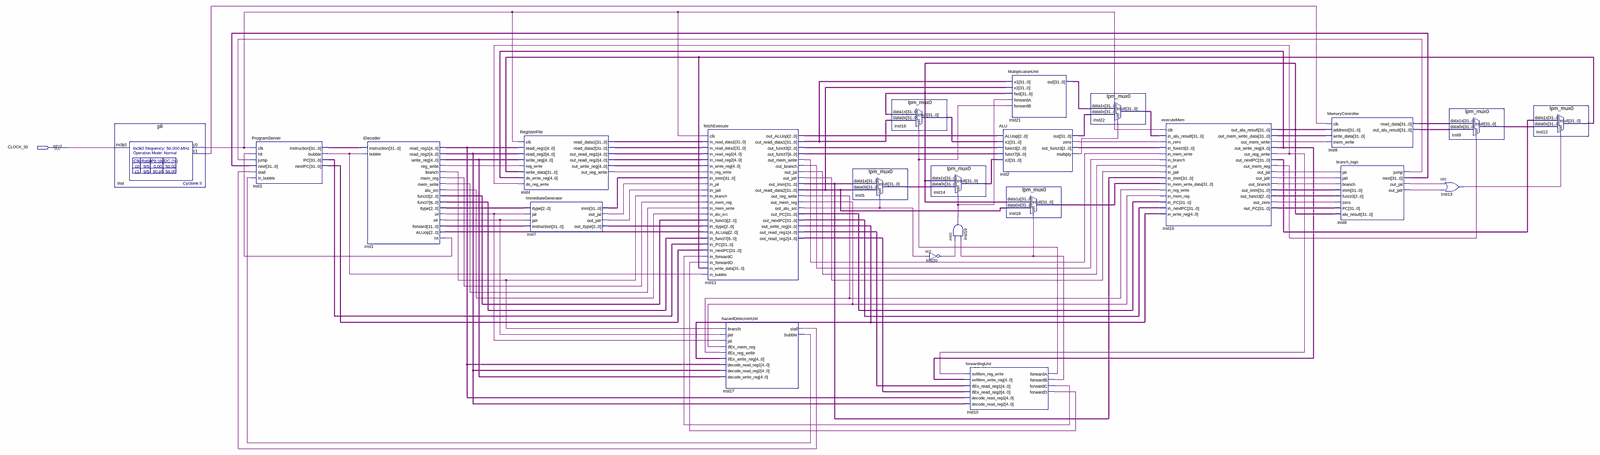
[diagram p0: schematic sheet, whole]
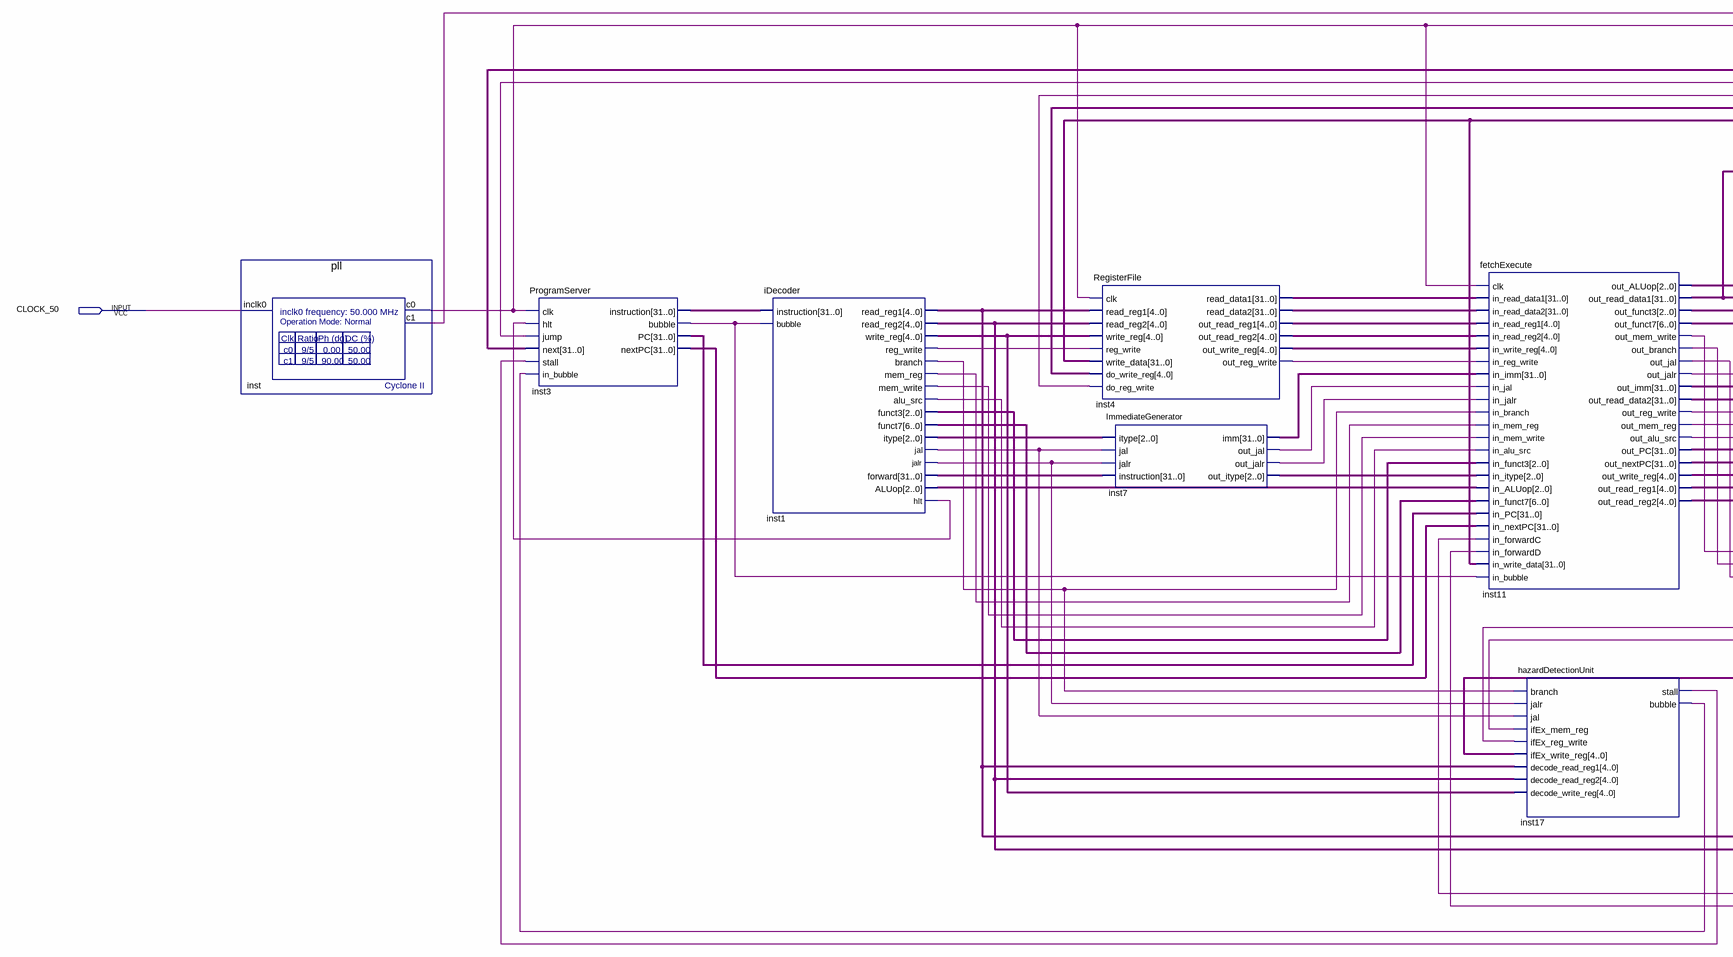
[diagram p1: schematic sheet, left part]
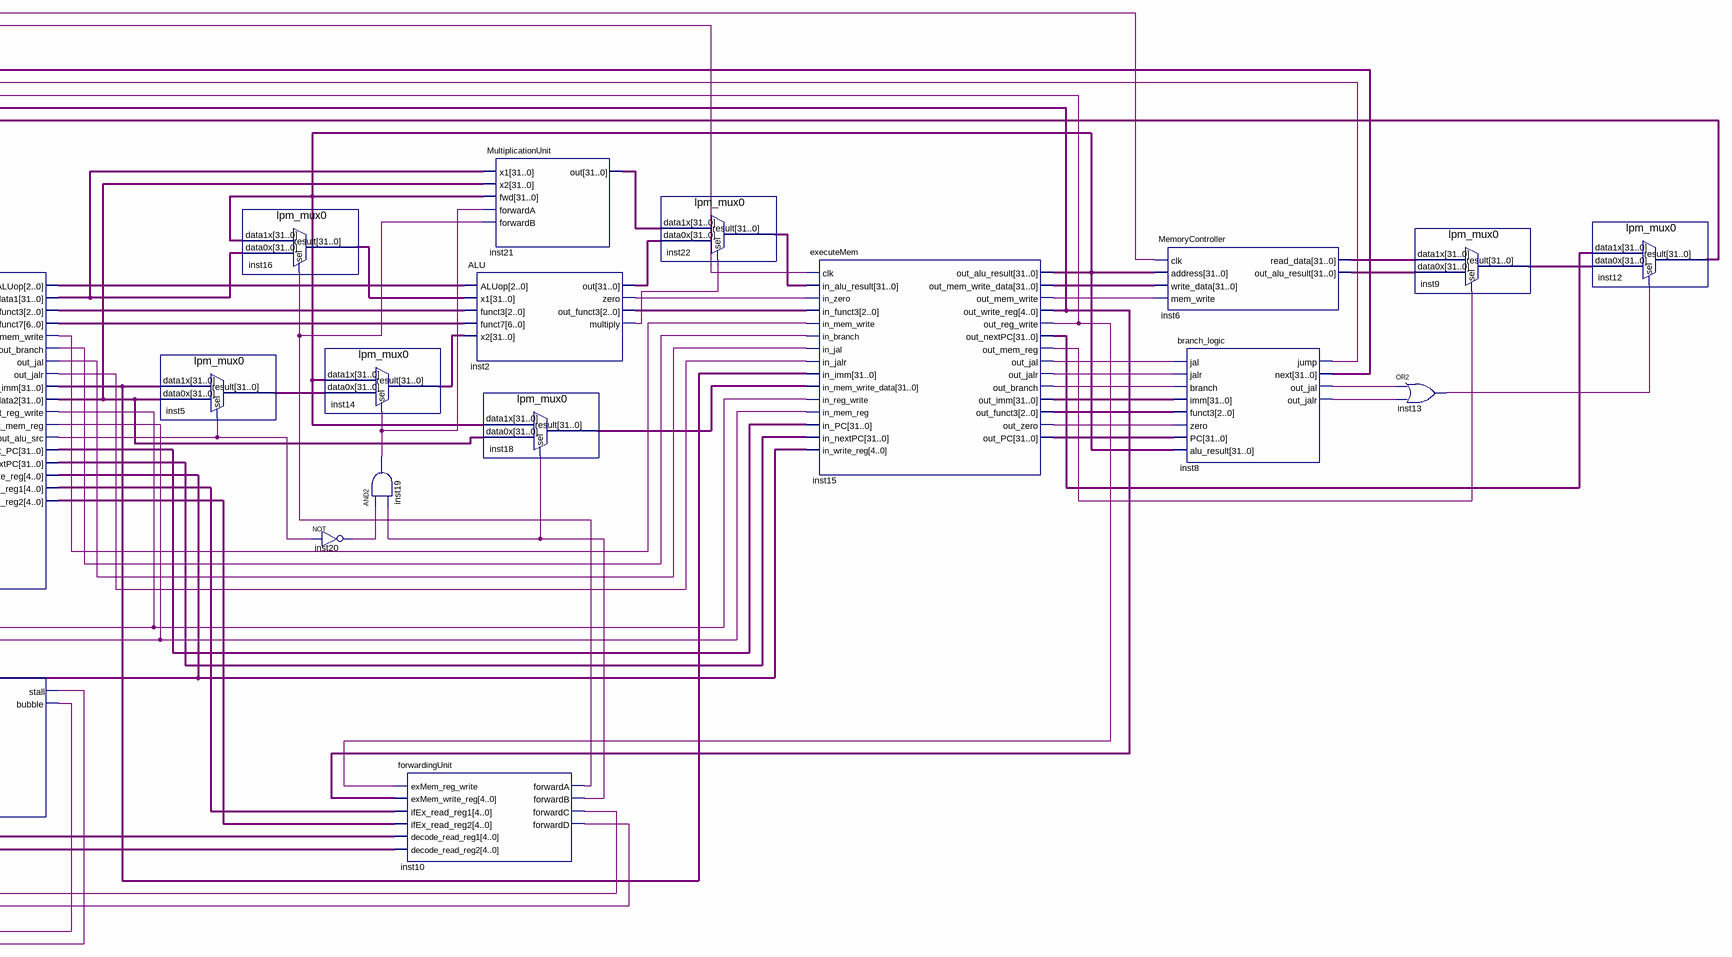
[diagram p2: schematic sheet, right part]
// Quartus schematic pipeline.bdf as structural Verilog: 23 symbols, 1 pins
module pipeline (
  input  CLOCK_50
);

  wire inst1_alu_src, inst1_branch, inst1_hlt, inst1_jal, inst1_jalr, inst1_mem_reg, inst1_mem_write,
       inst1_reg_write, inst2_multiply, inst2_zero, inst3_bubble, inst4_out_reg_write, inst7_out_jal,
       inst7_out_jalr, inst8_jump, inst8_out_jal, inst8_out_jalr, inst10_forwarda, inst10_forwardb,
       inst10_forwardc, inst10_forwardd, inst11_out_alu_src, inst11_out_branch, inst11_out_jal,
       inst11_out_jalr, inst11_out_mem_reg, inst11_out_mem_write, inst11_out_reg_write, inst13_out,
       inst15_out_branch, inst15_out_jal, inst15_out_jalr, inst15_out_mem_reg, inst15_out_mem_write,
       inst15_out_reg_write, inst15_out_zero, inst17_bubble, inst17_stall, inst19_out, inst20_out, inst_c0,
       inst_c1;
  wire [2:0] inst1_aluop, inst1_funct3, inst1_itype, inst2_out_funct3, inst7_out_itype, inst11_out_aluop,
       inst11_out_funct3, inst15_out_funct3;
  wire [4:0] inst1_read_reg1, inst1_read_reg2, inst1_write_reg, inst4_out_read_reg1, inst4_out_read_reg2,
       inst4_out_write_reg, inst11_out_read_reg1, inst11_out_read_reg2, inst11_out_write_reg,
       inst15_out_write_reg;
  wire [6:0] inst1_funct7, inst11_out_funct7;
  wire [31:0] inst1_forward, inst2_out, inst3_instruction, inst3_nextpc, inst3_pc, inst4_read_data1,
       inst4_read_data2, inst5_result, inst6_out_alu_result, inst6_read_data, inst7_imm, inst8_next,
       inst9_result, inst11_out_imm, inst11_out_nextpc, inst11_out_pc, inst11_out_read_data1,
       inst11_out_read_data2, inst12_result, inst14_result, inst15_out_alu_result, inst15_out_imm,
       inst15_out_mem_write_data, inst15_out_nextpc, inst15_out_pc, inst16_result, inst18_result, inst21_out,
       inst22_result;

  pll inst (.inclk0(CLOCK_50), .c0(inst_c0), .c1(inst_c1));
  ProgramServer inst3 (
    .clk(inst_c0), .hlt(inst1_hlt), .jump(inst8_jump), .next(inst8_next), .stall(inst17_stall),
    .in_bubble(inst17_bubble), .instruction(inst3_instruction), .bubble(inst3_bubble), .PC(inst3_pc),
    .nextPC(inst3_nextpc));
  iDecoder inst1 (
    .instruction(inst3_instruction), .bubble(inst3_bubble), .read_reg1(inst1_read_reg1),
    .read_reg2(inst1_read_reg2), .write_reg(inst1_write_reg), .reg_write(inst1_reg_write),
    .branch(inst1_branch), .mem_reg(inst1_mem_reg), .mem_write(inst1_mem_write), .alu_src(inst1_alu_src),
    .funct3(inst1_funct3), .funct7(inst1_funct7), .itype(inst1_itype), .jal(inst1_jal), .jalr(inst1_jalr),
    .forward(inst1_forward), .ALUop(inst1_aluop), .hlt(inst1_hlt));
  RegisterFile inst4 (
    .clk(inst_c0), .read_reg1(inst1_read_reg1), .read_reg2(inst1_read_reg2), .write_reg(inst1_write_reg),
    .reg_write(inst1_reg_write), .write_data(inst12_result), .do_write_reg(inst15_out_write_reg),
    .do_reg_write(inst15_out_reg_write), .read_data1(inst4_read_data1), .read_data2(inst4_read_data2),
    .out_read_reg1(inst4_out_read_reg1), .out_read_reg2(inst4_out_read_reg2),
    .out_write_reg(inst4_out_write_reg), .out_reg_write(inst4_out_reg_write));
  ImmediateGenerator inst7 (
    .itype(inst1_itype), .jal(inst1_jal), .jalr(inst1_jalr), .instruction(inst1_forward), .imm(inst7_imm),
    .out_jal(inst7_out_jal), .out_jalr(inst7_out_jalr), .out_itype(inst7_out_itype));
  fetchExecute inst11 (
    .clk(inst_c0), .in_read_data1(inst4_read_data1), .in_read_data2(inst4_read_data2),
    .in_read_reg1(inst4_out_read_reg1), .in_read_reg2(inst4_out_read_reg2),
    .in_write_reg(inst4_out_write_reg), .in_reg_write(inst4_out_reg_write), .in_imm(inst7_imm),
    .in_jal(inst7_out_jal), .in_jalr(inst7_out_jalr), .in_branch(inst1_branch), .in_mem_reg(inst1_mem_reg),
    .in_mem_write(inst1_mem_write), .in_alu_src(inst1_alu_src), .in_funct3(inst1_funct3),
    .in_itype(inst7_out_itype), .in_ALUop(inst1_aluop), .in_funct7(inst1_funct7), .in_PC(inst3_pc),
    .in_nextPC(inst3_nextpc), .in_forwardC(inst10_forwardc), .in_forwardD(inst10_forwardd),
    .in_write_data(inst12_result), .in_bubble(inst3_bubble), .out_ALUop(inst11_out_aluop),
    .out_read_data1(inst11_out_read_data1), .out_funct3(inst11_out_funct3), .out_funct7(inst11_out_funct7),
    .out_mem_write(inst11_out_mem_write), .out_branch(inst11_out_branch), .out_jal(inst11_out_jal),
    .out_jalr(inst11_out_jalr), .out_imm(inst11_out_imm), .out_read_data2(inst11_out_read_data2),
    .out_reg_write(inst11_out_reg_write), .out_mem_reg(inst11_out_mem_reg), .out_alu_src(inst11_out_alu_src),
    .out_PC(inst11_out_pc), .out_nextPC(inst11_out_nextpc), .out_write_reg(inst11_out_write_reg),
    .out_read_reg1(inst11_out_read_reg1), .out_read_reg2(inst11_out_read_reg2));
  hazardDetectionUnit inst17 (
    .branch(inst1_branch), .jalr(inst1_jalr), .jal(inst1_jal), .ifEx_mem_reg(inst11_out_mem_reg),
    .ifEx_reg_write(inst11_out_reg_write), .ifEx_write_reg(inst11_out_write_reg),
    .decode_read_reg1(inst1_read_reg1), .decode_read_reg2(inst1_read_reg2),
    .decode_write_reg(inst1_write_reg), .stall(inst17_stall), .bubble(inst17_bubble));
  lpm_mux0 inst5 (
    .data1x(inst11_out_imm), .data0x(inst11_out_read_data2), .sel(inst11_out_alu_src), .result(inst5_result));
  lpm_mux0 inst16 (
    .data1x(inst15_out_alu_result), .data0x(inst11_out_read_data1), .sel(inst10_forwarda),
    .result(inst16_result));
  not inst20 (inst20_out, inst11_out_alu_src);
  lpm_mux0 inst14 (.data1x(inst15_out_alu_result), .data0x(inst5_result), .sel(inst19_out), .result(inst14_result));
  and inst19 (inst19_out, inst20_out, inst10_forwardb);
  forwardingUnit inst10 (
    .exMem_reg_write(inst15_out_reg_write), .exMem_write_reg(inst15_out_write_reg),
    .ifEx_read_reg1(inst11_out_read_reg1), .ifEx_read_reg2(inst11_out_read_reg2),
    .decode_read_reg1(inst1_read_reg1), .decode_read_reg2(inst1_read_reg2), .forwardA(inst10_forwarda),
    .forwardB(inst10_forwardb), .forwardC(inst10_forwardc), .forwardD(inst10_forwardd));
  ALU inst2 (
    .ALUop(inst11_out_aluop), .x1(inst16_result), .funct3(inst11_out_funct3), .funct7(inst11_out_funct7),
    .x2(inst14_result), .out(inst2_out), .zero(inst2_zero), .out_funct3(inst2_out_funct3),
    .multiply(inst2_multiply));
  MultiplicationUnit inst21 (
    .x1(inst11_out_read_data1), .x2(inst11_out_read_data2), .fwd(inst15_out_alu_result),
    .forwardA(inst19_out), .forwardB(inst10_forwarda), .out(inst21_out));
  lpm_mux0 inst18 (
    .data1x(inst15_out_alu_result), .data0x(inst11_out_read_data2), .sel(inst10_forwardb),
    .result(inst18_result));
  lpm_mux0 inst22 (.data1x(inst21_out), .data0x(inst2_out), .sel(inst2_multiply), .result(inst22_result));
  executeMem inst15 (
    .clk(inst_c0), .in_alu_result(inst22_result), .in_zero(inst2_zero), .in_funct3(inst2_out_funct3),
    .in_mem_write(inst11_out_mem_write), .in_branch(inst11_out_branch), .in_jal(inst11_out_jal),
    .in_jalr(inst11_out_jalr), .in_imm(inst11_out_imm), .in_mem_write_data(inst18_result),
    .in_reg_write(inst11_out_reg_write), .in_mem_reg(inst11_out_mem_reg), .in_PC(inst11_out_pc),
    .in_nextPC(inst11_out_nextpc), .in_write_reg(inst11_out_write_reg),
    .out_alu_result(inst15_out_alu_result), .out_mem_write_data(inst15_out_mem_write_data),
    .out_mem_write(inst15_out_mem_write), .out_write_reg(inst15_out_write_reg),
    .out_reg_write(inst15_out_reg_write), .out_nextPC(inst15_out_nextpc), .out_mem_reg(inst15_out_mem_reg),
    .out_jal(inst15_out_jal), .out_jalr(inst15_out_jalr), .out_branch(inst15_out_branch),
    .out_imm(inst15_out_imm), .out_funct3(inst15_out_funct3), .out_zero(inst15_out_zero),
    .out_PC(inst15_out_pc));
  MemoryController inst6 (
    .clk(inst_c1), .address(inst15_out_alu_result), .write_data(inst15_out_mem_write_data),
    .mem_write(inst15_out_mem_write), .read_data(inst6_read_data), .out_alu_result(inst6_out_alu_result));
  branch_logic inst8 (
    .jal(inst15_out_jal), .jalr(inst15_out_jalr), .branch(inst15_out_branch), .imm(inst15_out_imm),
    .funct3(inst15_out_funct3), .zero(inst15_out_zero), .PC(inst15_out_pc),
    .alu_result(inst15_out_alu_result), .jump(inst8_jump), .next(inst8_next), .out_jal(inst8_out_jal),
    .out_jalr(inst8_out_jalr));
  lpm_mux0 inst9 (
    .data1x(inst6_read_data), .data0x(inst6_out_alu_result), .sel(inst15_out_mem_reg), .result(inst9_result));
  or inst13 (inst13_out, inst8_out_jal, inst8_out_jalr);
  lpm_mux0 inst12 (.data1x(inst15_out_nextpc), .data0x(inst9_result), .sel(inst13_out), .result(inst12_result));
endmodule
